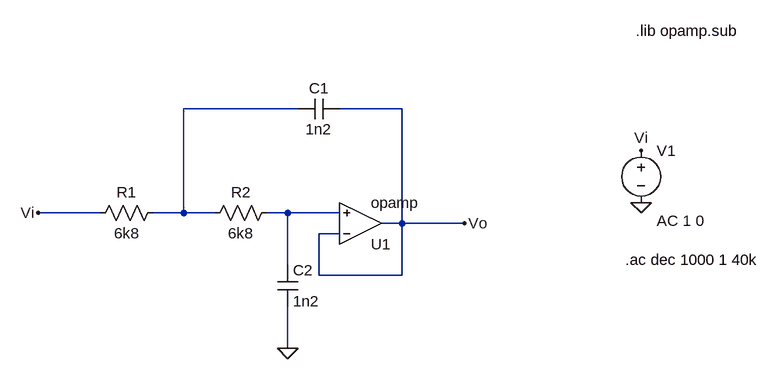
[diagram p0: schematic Sallen-Key.asc]
Sallen-Key.asc, the LTspice schematic file:
Version 4
SHEET 1 880 680
WIRE 96 16 -80 16
WIRE 256 16 160 16
WIRE -208 176 -304 176
WIRE -80 176 -80 16
WIRE -80 176 -128 176
WIRE -32 176 -80 176
WIRE 80 176 48 176
WIRE 160 176 80 176
WIRE 256 192 256 16
WIRE 256 192 224 192
WIRE 352 192 256 192
WIRE 160 208 128 208
WIRE 80 256 80 176
WIRE 128 272 128 208
WIRE 256 272 256 192
WIRE 256 272 128 272
WIRE 80 384 80 320
FLAG 80 384 0
FLAG 352 192 Vo
FLAG -304 176 Vi
FLAG 624 160 0
FLAG 624 80 Vi
SYMBOL OpAmps\\opamp 192 256 M180
SYMATTR InstName U1
SYMBOL res 64 160 R90
WINDOW 0 0 56 VBottom 2
WINDOW 3 32 56 VTop 2
SYMATTR InstName R2
SYMATTR Value 6k8
SYMBOL res -112 160 R90
WINDOW 0 0 56 VBottom 2
WINDOW 3 32 56 VTop 2
SYMATTR InstName R1
SYMATTR Value 6k8
SYMBOL cap 64 256 R0
SYMATTR InstName C2
SYMATTR Value 1n2
SYMBOL cap 160 0 R90
WINDOW 0 0 32 VBottom 2
WINDOW 3 32 32 VTop 2
SYMATTR InstName C1
SYMATTR Value 1n2
SYMBOL voltage 624 64 R0
WINDOW 123 24 124 Left 2
WINDOW 39 0 0 Left 0
SYMATTR InstName V1
SYMATTR Value ""
SYMATTR Value2 AC 1 0
TEXT 616 -104 Left 2 !.lib opamp.sub
TEXT 600 248 Left 2 !.ac dec 1000 1 40k

The netlist it stands for:
* Sallen-Key.asc
XU1 Vo N002 Vo opamp Aol=100K GBW=10Meg  ; pins invin noninvin out
R2 N002 N001 6k8
R1 N001 Vi 6k8
C2 N002 0 1n2
C1 Vo N001 1n2
V1 Vi 0 AC 1 0
.lib opamp.sub
.ac dec 1000 1 40k
.backanno
.end